# Altium schematic sheet PART1.SchDoc
size 558 x 431 mm
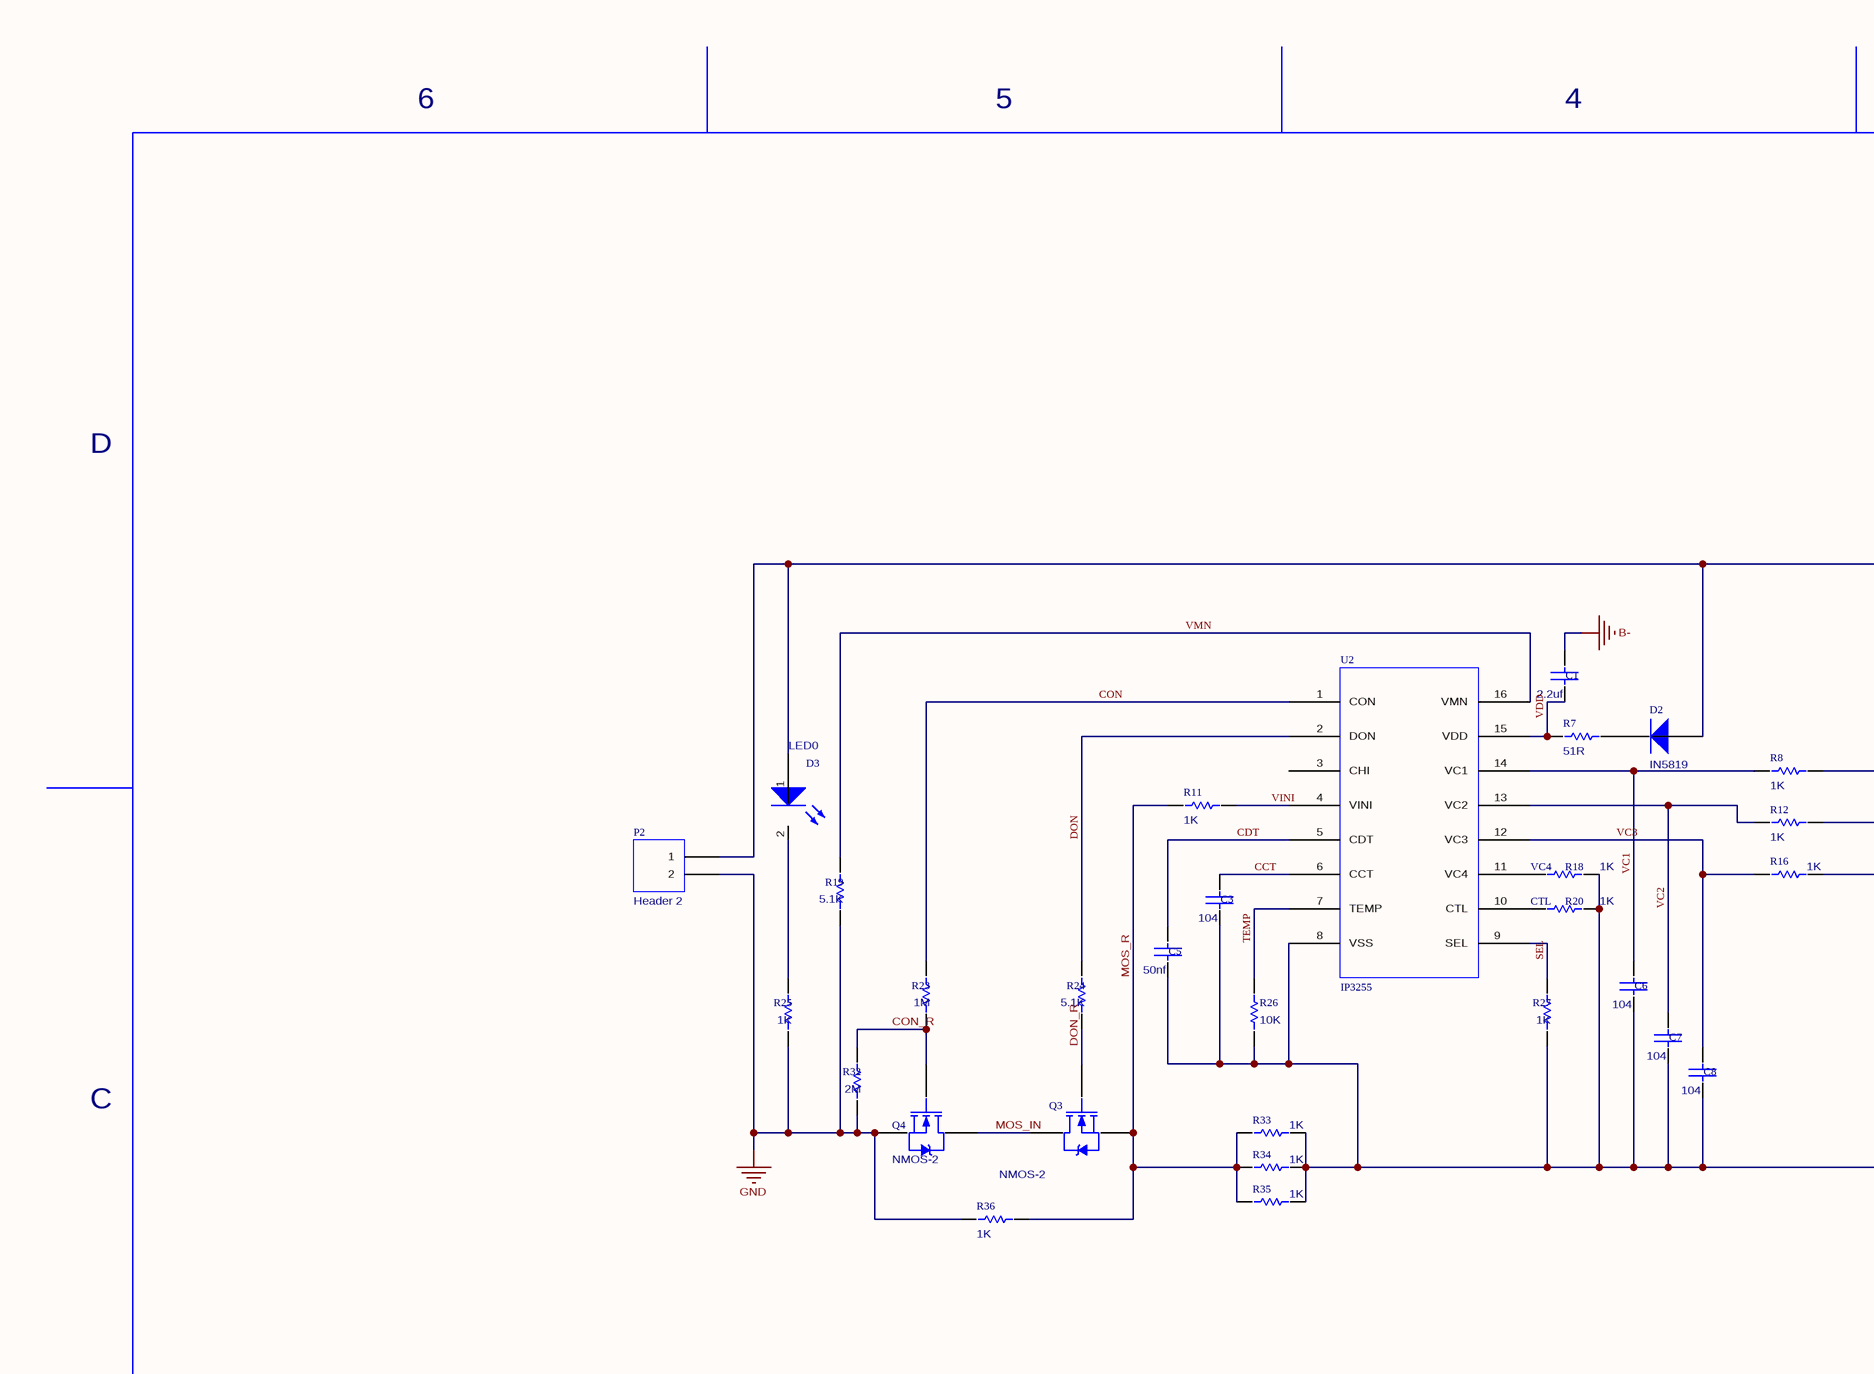
[diagram p0: PART1.SchDoc, top left]
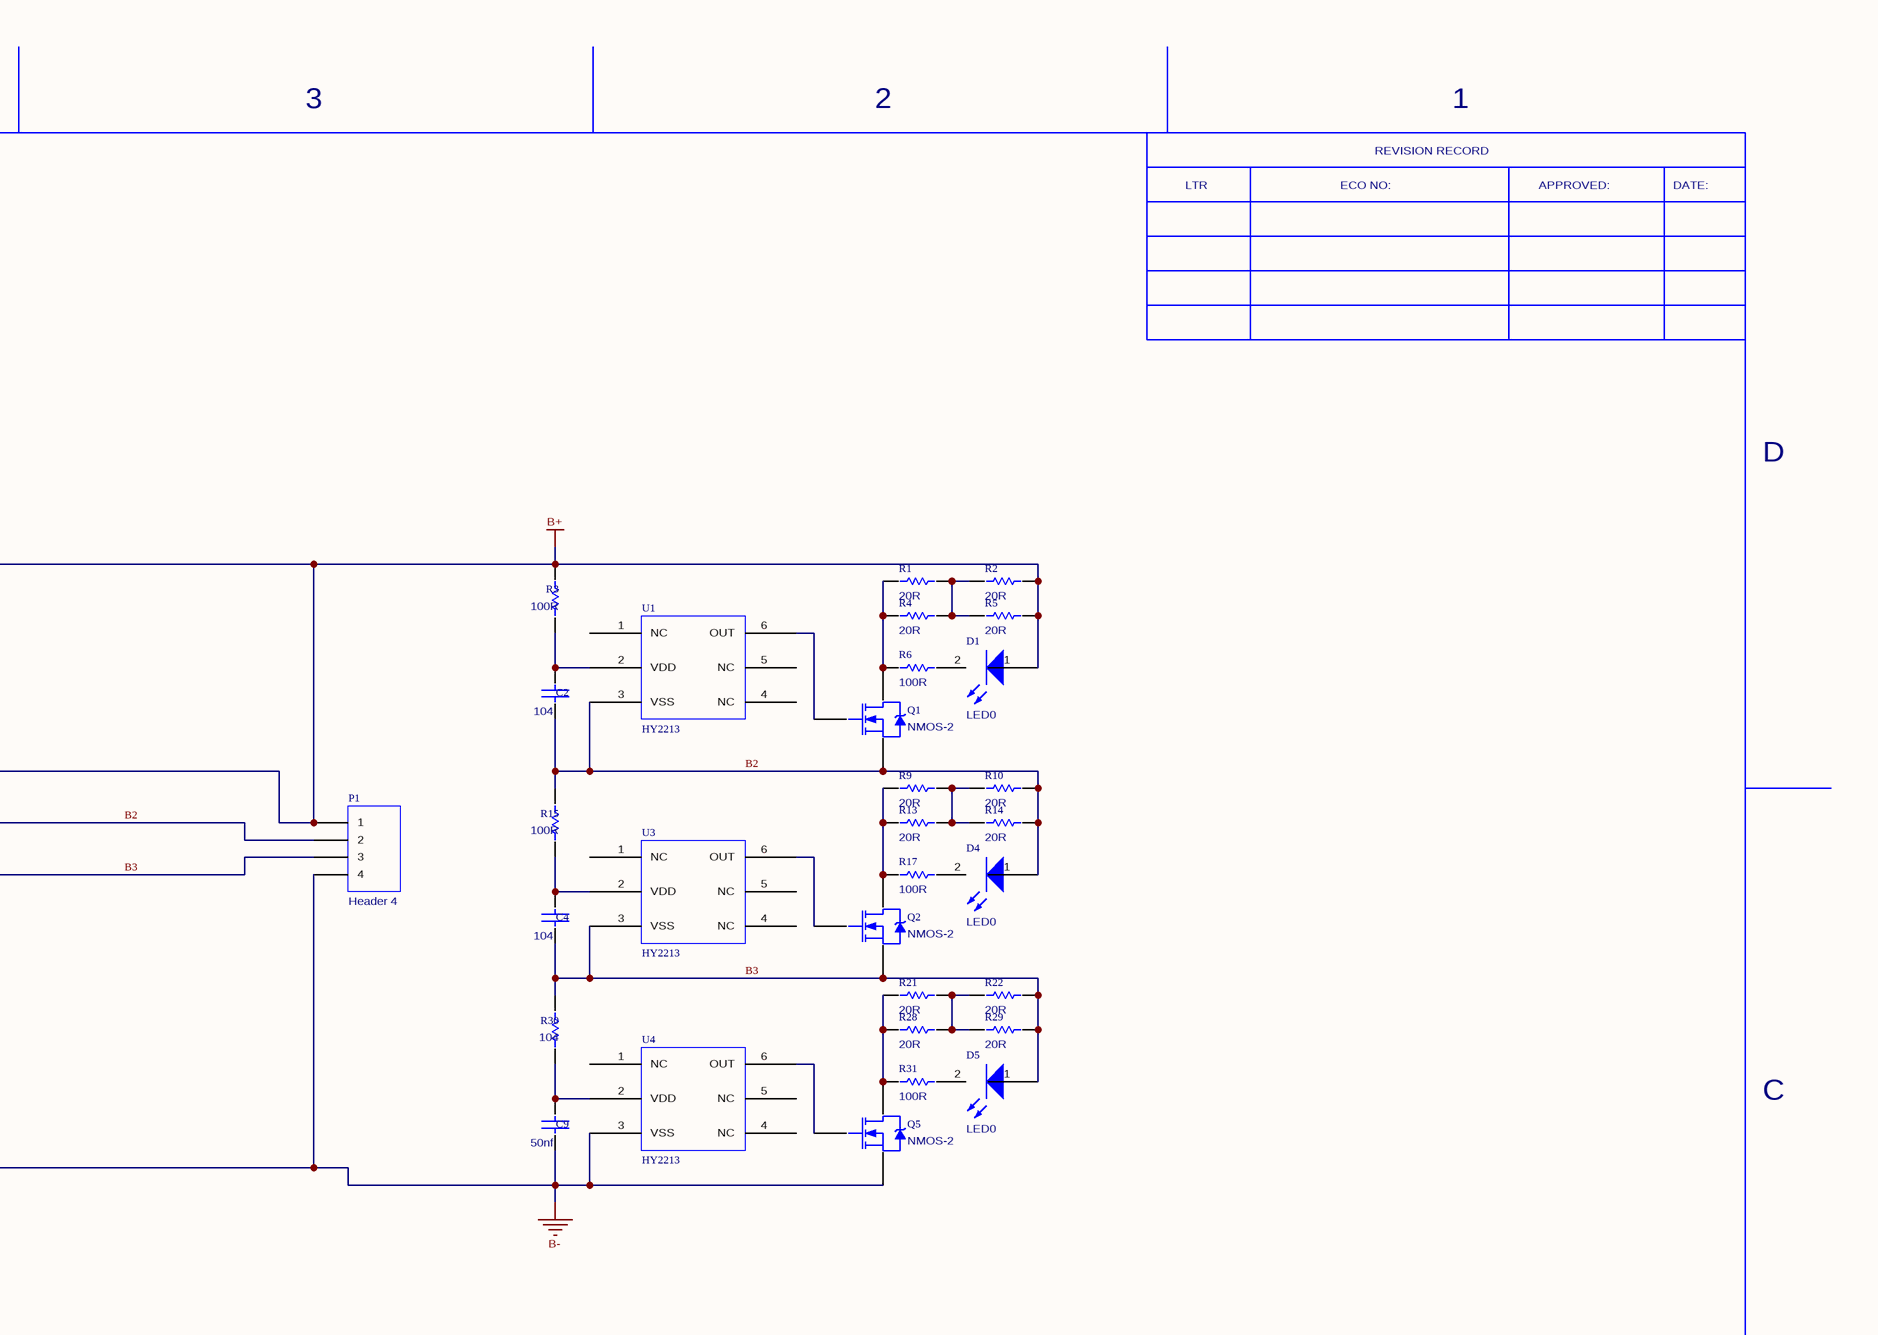
[diagram p1: PART1.SchDoc, top right]
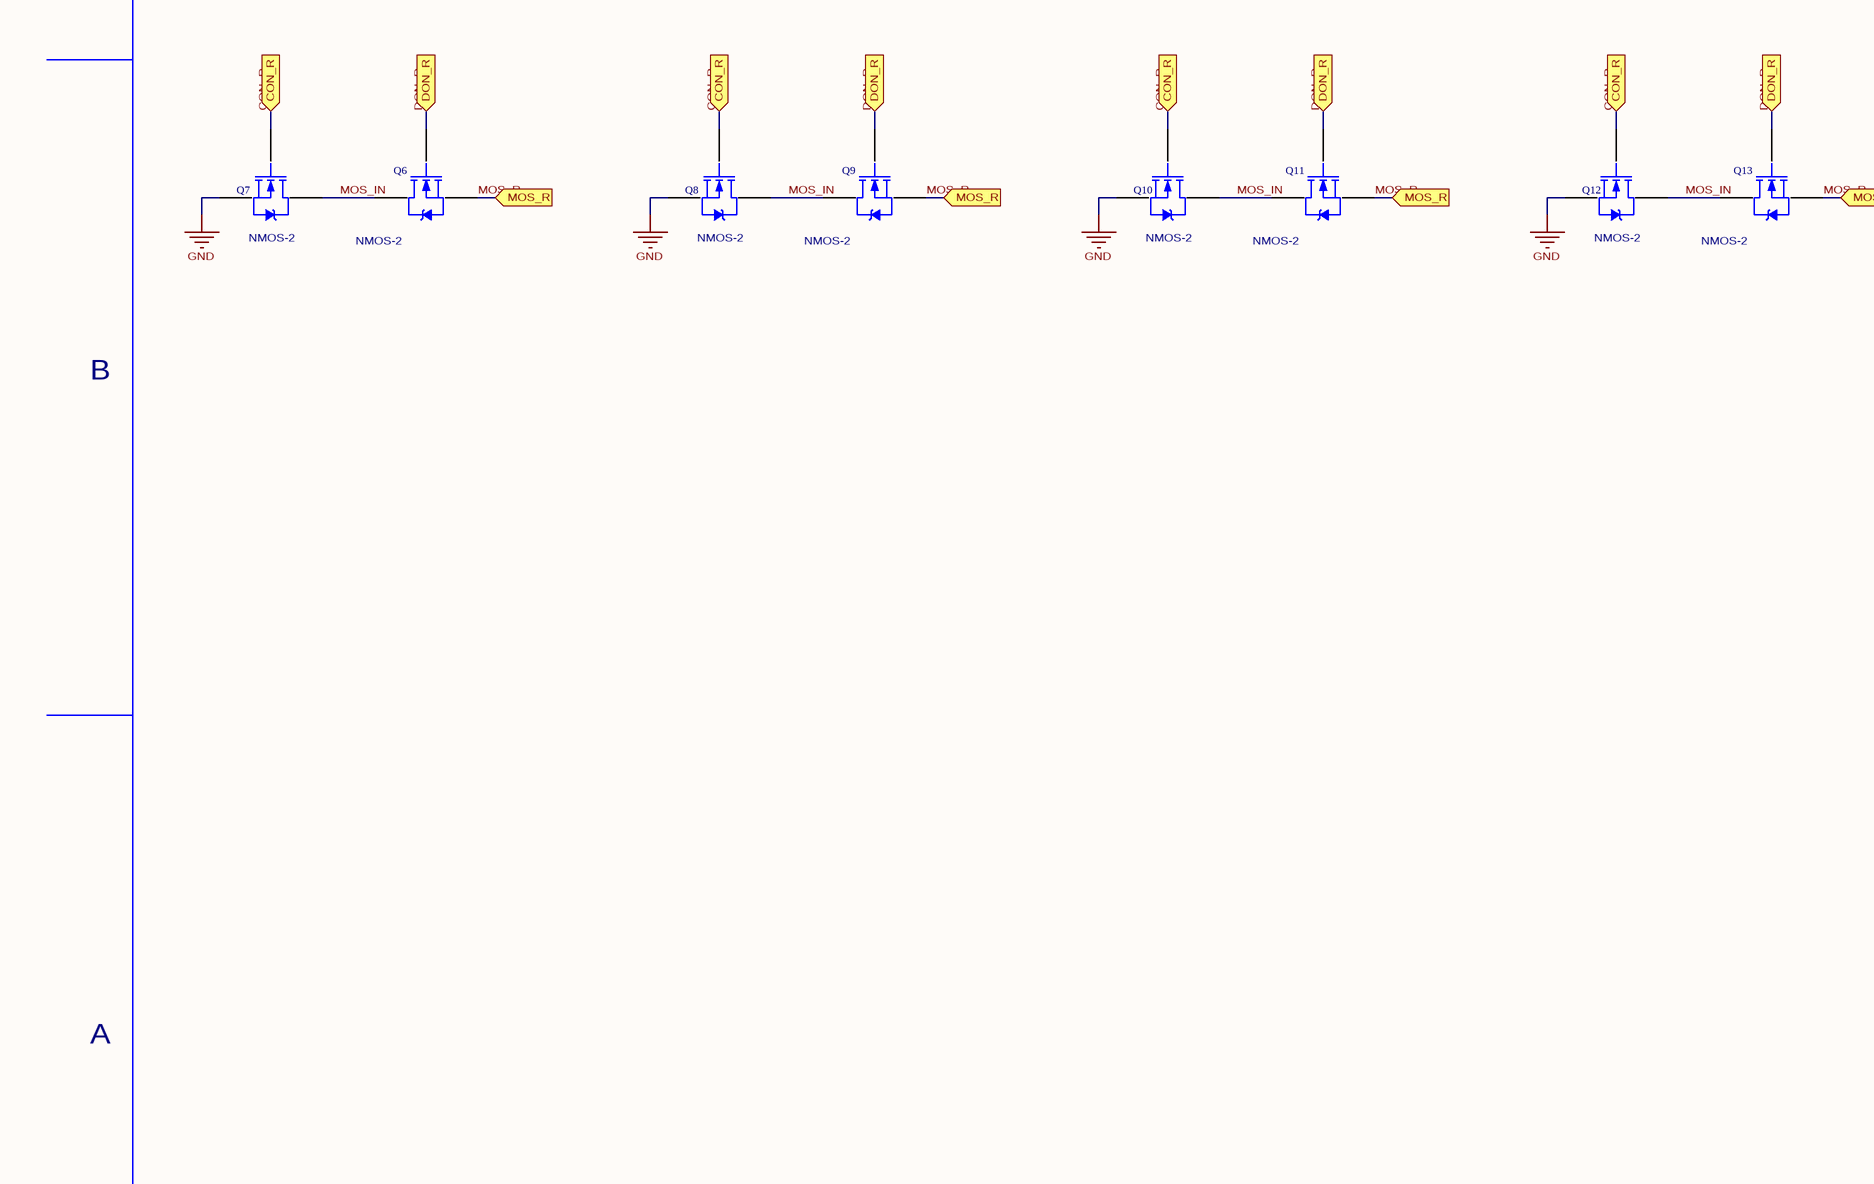
[diagram p2: PART1.SchDoc, bottom left]
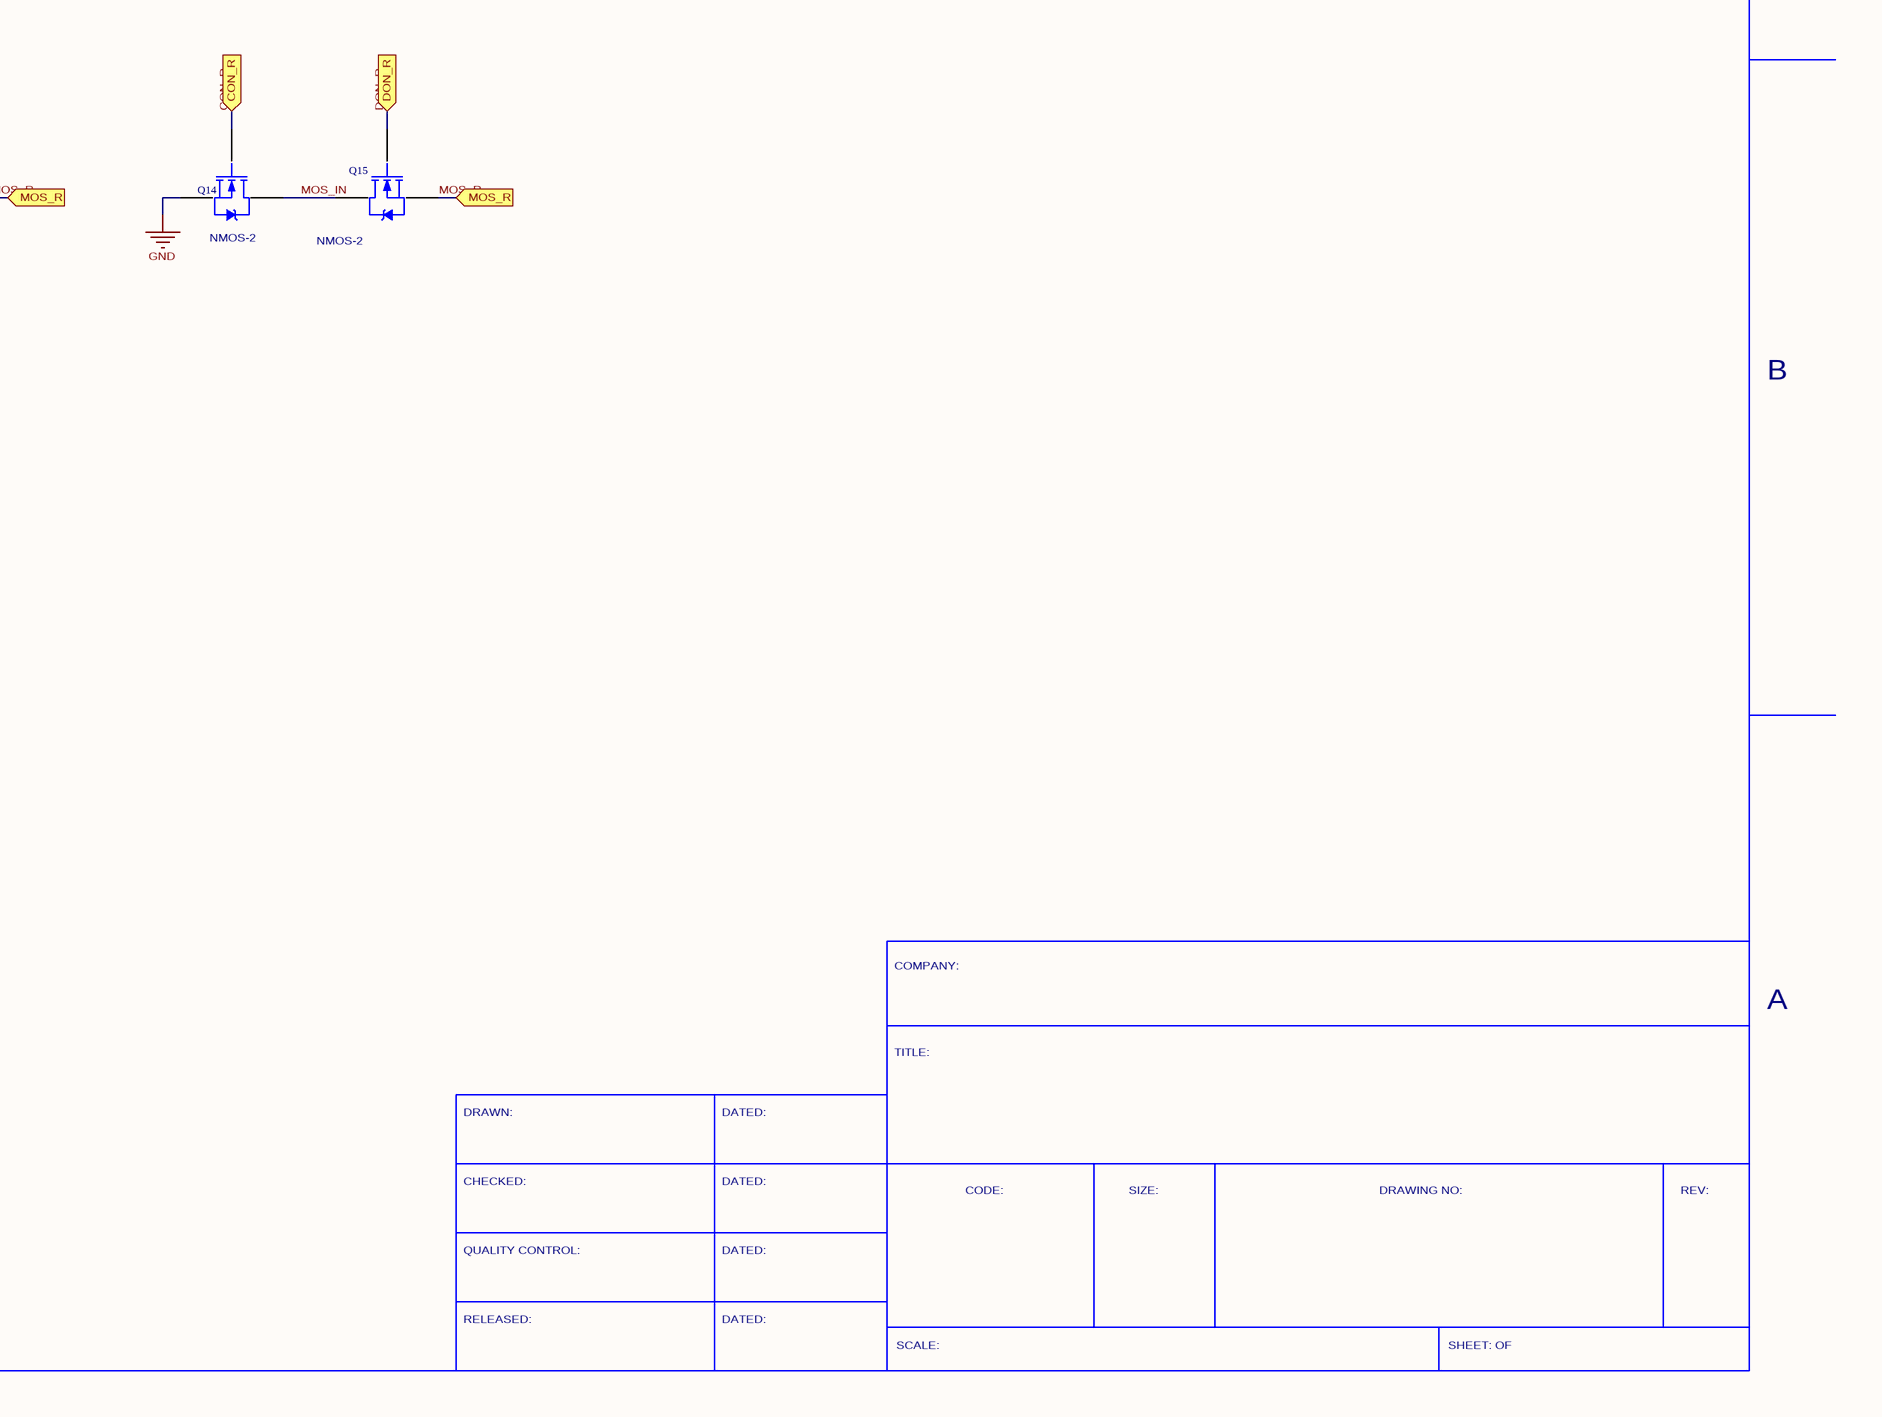
[diagram p3: PART1.SchDoc, bottom right]

## Parts
C1  value 2.2uf  [0805C]  (hidden comment: CAP)
C2  value 104  [0603C]  (hidden comment: CAP)
C3  value 104  [0805C]  (hidden comment: CAP)
C4  value 104  [0603C]  (hidden comment: CAP)
C5  value 50nf  [0805C]  (hidden comment: CAP)
C6  value 104  [0603C]  (hidden comment: CAP)
C7  value 104  [0603C]  (hidden comment: CAP)
C8  value 104  [0603C]  (hidden comment: CAP)
C9  value 50nf  [0603C]  (hidden comment: CAP)
D1  LED0  [0805D]  (value not drawn)
D2  DIODE_1N4001  [SOD123]  (value not drawn)
D3  LED0  [0805D]  (value not drawn)
D4  LED0  [0805D]  (value not drawn)
D5  LED0  [0805D]  (value not drawn)
P1  HEADER_4  [2.54/4PM]  (value not drawn)
P2  HEADER_2  [KF127_2]  (value not drawn)
Q1  NMOS-2_2  [SOT23-3]  (value not drawn)
Q2  NMOS-2_2  [SOT23-3]  (value not drawn)
Q3  NMOS-2  [TO252-3]  (value not drawn)
Q4  NMOS-2  [TO252-3]  (value not drawn)
Q5  NMOS-2_2  [SOT23-3]  (value not drawn)
Q6  NMOS-2  [TO252-3]  (value not drawn)
Q7  NMOS-2  [TO252-3]  (value not drawn)
Q8  NMOS-2  [TO252-3]  (value not drawn)
Q9  NMOS-2  [TO252-3]  (value not drawn)
Q10  NMOS-2  [TO252-3]  (value not drawn)
Q11  NMOS-2  [TO252-3]  (value not drawn)
Q12  NMOS-2  [TO252-3]  (value not drawn)
Q13  NMOS-2  [TO252-3]  (value not drawn)
Q14  NMOS-2  [TO252-3]  (value not drawn)
Q15  NMOS-2  [TO252-3]  (value not drawn)
R1  value 20R  [1206C]  (hidden comment: RES_SEMI)
R2  value 20R  [1206C]  (hidden comment: RES_SEMI)
R3  value 100R  [0603R]  (hidden comment: RES_SEMI)
R4  value 20R  [1206C]  (hidden comment: RES_SEMI)
R5  value 20R  [1206C]  (hidden comment: RES_SEMI)
R6  value 100R  [0805R]  (hidden comment: RES_SEMI)
R7  value 51R  [0805R]  (hidden comment: RES_SEMI)
R8  value 1K  [0603R]  (hidden comment: RES_SEMI)
R9  value 20R  [1206C]  (hidden comment: RES_SEMI)
R10  value 20R  [1206C]  (hidden comment: RES_SEMI)
R11  value 1K  [0805R]  (hidden comment: RES_SEMI)
R12  value 1K  [0603R]  (hidden comment: RES_SEMI)
R13  value 20R  [1206C]  (hidden comment: RES_SEMI)
R14  value 20R  [1206C]  (hidden comment: RES_SEMI)
R15  value 100R  [0603R]  (hidden comment: RES_SEMI)
R16  value 1K  [0603R]  (hidden comment: RES_SEMI)
R17  value 100R  [0805R]  (hidden comment: RES_SEMI)
R18  value 1K  [0805R]  (hidden comment: RES_SEMI)
R19  value 5.1K  [0805R]  (hidden comment: RES_SEMI)
R20  value 1K  [0805R]  (hidden comment: RES_SEMI)
R21  value 20R  [1206C]  (hidden comment: RES_SEMI)
R22  value 20R  [1206C]  (hidden comment: RES_SEMI)
R23  value 1M  [0805R]  (hidden comment: RES_SEMI)
R24  value 5.1K  [0805R]  (hidden comment: RES_SEMI)
R25  value 1K  [0805R]  (hidden comment: RES_SEMI)
R26  value 10K  [0805R]  (hidden comment: RES_SEMI)
R27  value 1K  [0805R]  (hidden comment: RES_SEMI)
R28  value 20R  [1206C]  (hidden comment: RES_SEMI)
R29  value 20R  [1206C]  (hidden comment: RES_SEMI)
R30  value 104  [0603R]  (hidden comment: RES_SEMI)
R31  value 100R  [0805R]  (hidden comment: RES_SEMI)
R32  value 2M  [0805R]  (hidden comment: RES_SEMI)
R33  value 1K  [3920R]  (hidden comment: RES_SEMI)
R34  value 1K  [3920R]  (hidden comment: RES_SEMI)
R35  value 1K  [3920R]  (hidden comment: RES_SEMI)
R36  value 1K  [0805R]  (hidden comment: RES_SEMI)
U1  HY2213  [SOT23-6]  (value not drawn)
U2  IP3255  [TSSOP16-OR65-4R40]  (value not drawn)
U3  HY2213  [SOT23-6]  (value not drawn)
U4  HY2213  [SOT23-6]  (value not drawn)

## Ports
CON_R, DON_R, MOS_R

## Nets
B+: D1.1(A) D2.1(A) D3.1(A) P1.1 P2.1 R2.2 R3.2 R5.2 R8.2
B-: C1.2 C3.1 C5.1 C6.1 C7.1 C8.1 C9.1 P1.4 Q5.2(S) R18.2 R20.2 R26.2 R27.1 R33.2 R34.2 R35.2 U2.8(VSS) U4.3(VSS)
GND: P2.2 Q4.3(S) Q7.3(S) Q8.3(S) Q10.3(S) Q12.3(S) Q14.3(S) R19.1 R25.1 R32.1 R36.2
B2: C2.1 D4.1(A) P1.2 Q1.2(S) R10.2 R12.2 R14.2 R15.2 U1.3(VSS)
B3: C4.1 D5.1(A) P1.3 Q2.2(S) R16.1 R22.2 R29.2 R30.2 U3.3(VSS)
CCT: C3.2 U2.6(CCT)
CDT: C5.2 U2.5(CDT)
CON: R23.2 U2.1(CON)
CON_R: Q4.1(G) Q7.1(G) Q8.1(G) Q10.1(G) Q12.1(G) Q14.1(G) R23.1 R32.2 ; port CON_R
DON: R24.2 U2.2(DON)
DON_R: Q3.1(G) Q6.1(G) Q9.1(G) Q11.1(G) Q13.1(G) Q15.1(G) R24.1 ; port DON_R
MOS_IN: Q3.2(D) Q4.2(D) Q6.2(D) Q7.2(D) Q8.2(D) Q9.2(D) Q10.2(D) Q11.2(D) Q12.2(D) Q13.2(D) Q14.2(D) Q15.2(D)
MOS_R: Q3.3(S) Q6.3(S) Q9.3(S) Q11.3(S) Q13.3(S) Q15.3(S) R11.2 R33.1 R34.1 R35.1 R36.1 ; port MOS_R
SEL: R27.2 U2.9(SEL)
TEMP: R26.1 U2.7(TEMP)
VC1: C6.2 R8.1 U2.14(VC1)
VC2: C7.2 R12.1 U2.13(VC2)
VC3: C8.2 R16.2 U2.12(VC3)
VDD: C1.1 R7.1 U2.15(VDD)
VINI: R11.1 U2.4(VINI)
VMN: R19.2 U2.16(VMN)
NetC2_2: C2.2 R3.1 U1.2(VDD)
NetC4_2: C4.2 R15.1 U3.2(VDD)
NetC9_2: C9.2 R30.1 U4.2(VDD)
NetD1_2: D1.2(K) R6.2
NetD2_2: D2.2(K) R7.2
NetD3_2: D3.2(K) R25.2
NetD4_2: D4.2(K) R17.2
NetD5_2: D5.2(K) R31.2
NetQ1_1: Q1.1(G) U1.6(OUT)
NetQ1_3: Q1.3(D) R1.1 R4.1 R6.1
NetQ2_1: Q2.1(G) U3.6(OUT)
NetQ2_3: Q2.3(D) R9.1 R13.1 R17.1
NetQ5_1: Q5.1(G) U4.6(OUT)
NetQ5_3: Q5.3(D) R21.1 R28.1 R31.1
NetR1_2: R1.2 R2.1 R4.2 R5.1
NetR9_2: R9.2 R10.1 R13.2 R14.1
NetR18_1: R18.1 U2.11(VC4)
NetR20_1: R20.1 U2.10(CTL)
NetR21_2: R21.2 R22.1 R28.2 R29.1

Not connected (* = marked no-connect by the designer): U1 1(NC) 4(NC) 5(NC); U2 3(CHI); U3 1(NC) 4(NC) 5(NC); U4 1(NC) 4(NC) 5(NC)

## Notes on the sheet
- 6
- 5
- 4
- 3
- 2
- 1
- LTR
- ECO NO:
- REVISION RECORD
- APPROVED:
- DATE:
- D
- (near R18) VC4
- (near R20) CTL
- C
- B
- COMPANY:
- A
- TITLE:
- DRAWN:
- DATED:
- CHECKED:
- CODE:
- SIZE:
- DRAWING NO:
- REV:
- QUALITY CONTROL:
- RELEASED:
- SCALE:
- SHEET: OF

## Library data of the parts
C1-C9 = CAP: Capacitor; Published: 8-Jun-2000; LatestRevisionDate: 17-Jul-2002; LatestRevisionNote: Re-released for DXP Platform.; PackageReference: RAD-0.3; Publisher: Altium Limited; PackageDescription: Radial Cap, Thru-Hole; 2 Leads; 0.3 in Pin Spacing
  C1 C3 C5: PCB DECAL: 0805C
  C2 C4 C6-C9: PCB DECAL: 0603C
D1 D3-D5 = LED0: Typical INFRARED GaAs LED; Published: 8-Jun-2000; LatestRevisionDate: 08-Jul-2005; LatestRevisionNote: Mech Layer 1 removed.; PackageReference: LED-0; Publisher: Altium Limited; PackageDescription: LED; 2 Leads; PCB DECAL: 0805D
D2 = DIODE_1N4001: 1 Amp General Purpose Rectifier; Published: 8-Jun-2000; LatestRevisionDate: 17-Jul-2002; LatestRevisionNote: Re-released for DXP Platform.; DatasheetVersion: 1998; PackageVersion: Aug-1999; PackageReference: DO-41; Publisher: Altium Limited; PackageDescription: Diode, Axial; Body 5.2 x 2.7 mm (LxDia. max), Lead Dia. 0.86 mm (max); Code_JEDEC: DO-204-AL; ComponentLink1Description: Manufacturer Link; ComponentLink1URL: http://www.fairchildsemi.com/; ComponentLink2Description: Datasheet; ComponentLink2URL: http://www.fairchildsemi.com/ds/1N%2F1N4001.pdf; PCB DECAL: SOD123
P1 = HEADER_4: Header, 4-Pin; LatestRevisionDate: 17-Jul-2002; LatestRevisionNote: Re-released for DXP Platform.; Publisher: Altium Limited; PCB DECAL: 2.54/4PM
P2 = HEADER_2: Header, 2-Pin; LatestRevisionDate: 17-Jul-2002; LatestRevisionNote: Re-released for DXP Platform.; Publisher: Altium Limited; PCB DECAL: KF127_2
Q1 Q2 Q5 = NMOS-2_2: N-Channel Power MOSFET; Note: Pin 2 is electrically connected to pin 4.; Published: 8-Jun-2000; LatestRevisionDate: 17-Jul-2002; LatestRevisionNote: Re-released for DXP Platform.; DatasheetVersion: PD-9.814; PackageVersion: Feb-1997; PackageReference: TO-220AB; Publisher: Altium Limited; PackageDescription: TO, Thru-Hole, Vertical, Heatsink Mounted; 3 In-Line Leads; Pitch 2.54 mm; ComponentLink1Description: Manufacturer Link; ComponentLink1URL: http://www.irf.com/; PCB DECAL: SOT23-3
Q3 Q4 Q6-Q15 = NMOS-2: N-Channel Power MOSFET; Note: Pin 2 is electrically connected to pin 4.; Published: 8-Jun-2000; LatestRevisionDate: 17-Jul-2002; LatestRevisionNote: Re-released for DXP Platform.; DatasheetVersion: PD-9.814; PackageVersion: Feb-1997; PackageReference: TO-220AB; Publisher: Altium Limited; PackageDescription: TO, Thru-Hole, Vertical, Heatsink Mounted; 3 In-Line Leads; Pitch 2.54 mm; ComponentLink1Description: Manufacturer Link; ComponentLink1URL: http://www.irf.com/; PCB DECAL: TO252-3
R1-R36 = RES_SEMI: Semiconductor Resistor; Published: 8-Jun-2000; LatestRevisionDate: 17-Jul-2002; LatestRevisionNote: Re-released for DXP Platform.; PackageReference: AXIAL-0.5; Publisher: Altium Limited; PackageDescription: Axial Device, Thru-Hole; 2 Leads; 0.5 in Pin Spacing
  R1 R2 R4 R5 R9 R10 R13 R14 R21 R22 R28 R29: PCB DECAL: 1206C
  R3 R8 R12 R15 R16 R30: PCB DECAL: 0603R
  R6 R7 R11 R17-R20 R23-R27 R31 R32 R36: PCB DECAL: 0805R
  R33-R35: PCB DECAL: 3920R
U1 U3 U4 = HY2213: PCB DECAL: SOT23-6
U2 = IP3255: PCB DECAL: TSSOP16-OR65-4R40